# EAGLE design LogicLab (EAGLE 7.6.0)
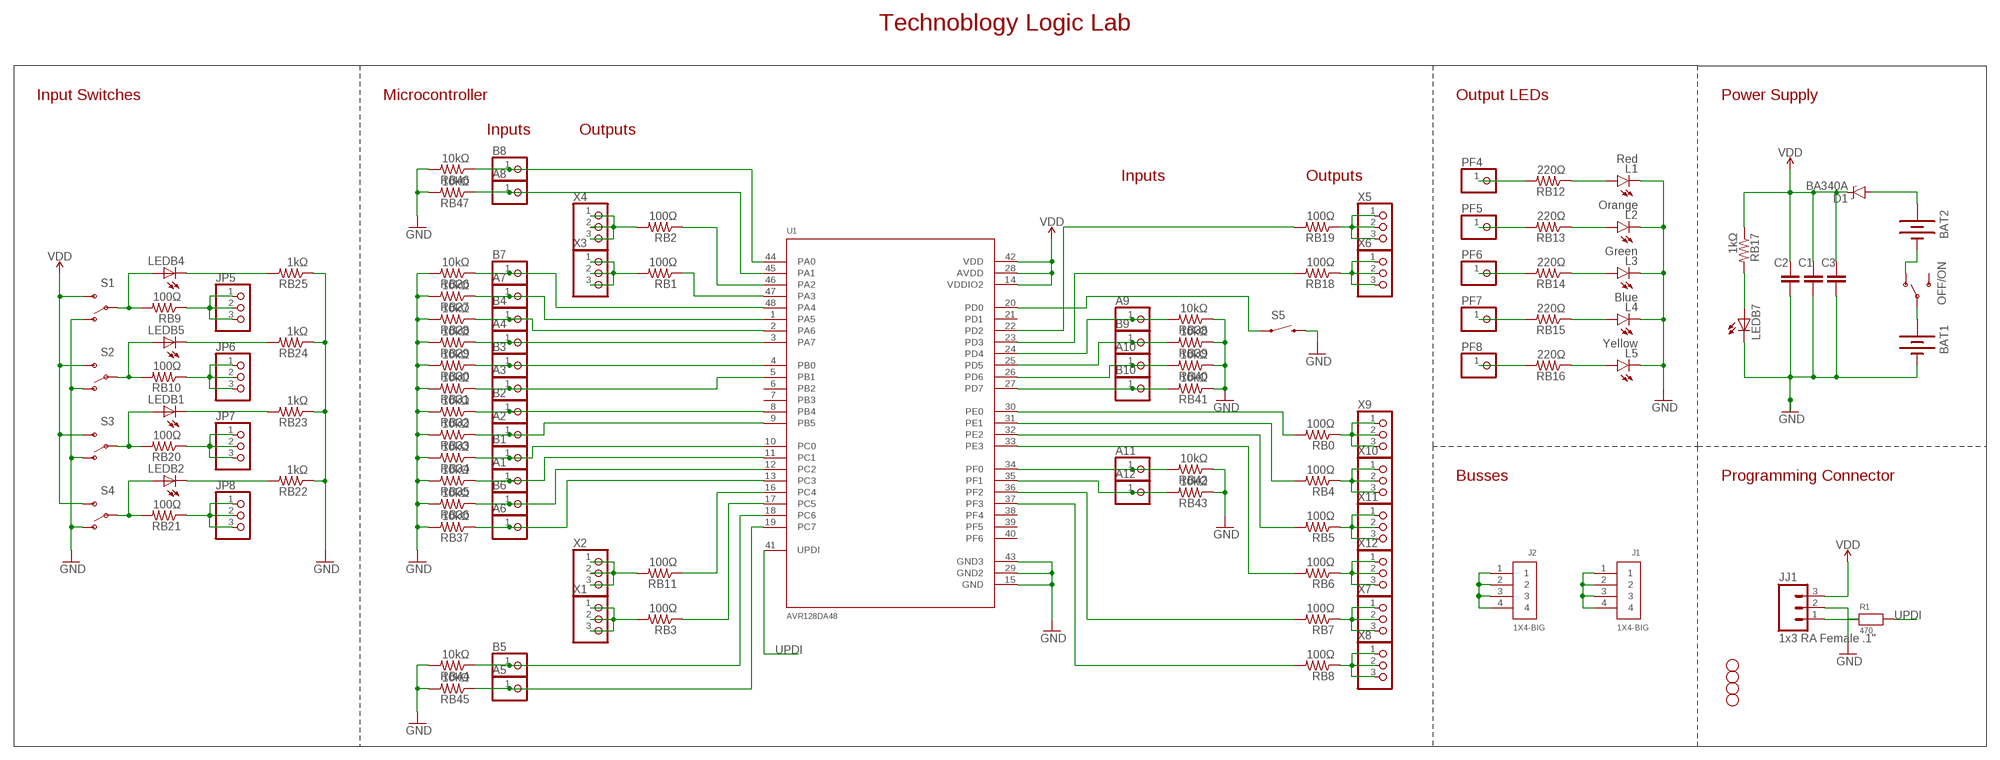
[diagram p0: schematic, sheet 1]

## Parts
A1  PINHD-1X1  [1X01]
A2  PINHD-1X1  [1X01]
A3  PINHD-1X1  [1X01]
A4  PINHD-1X1  [1X01]
A5  PINHD-1X1  [1X01]
A6  PINHD-1X1  [1X01]
A7  PINHD-1X1  [1X01]
A8  PINHD-1X1  [1X01]
A9  PINHD-1X1  [1X01]
A10  PINHD-1X1  [1X01]
A11  PINHD-1X1  [1X01]
A12  PINHD-1X1  [1X01]
B1  PINHD-1X1  [1X01]
B2  PINHD-1X1  [1X01]
B3  PINHD-1X1  [1X01]
B4  PINHD-1X1  [1X01]
B5  PINHD-1X1  [1X01]
B6  PINHD-1X1  [1X01]
B7  PINHD-1X1  [1X01]
B8  PINHD-1X1  [1X01]
B9  PINHD-1X1  [1X01]
B10  PINHD-1X1  [1X01]
BAT1  BATTERYAAA-KIT  [BATTERY-AAA-KIT]
BAT2  BATTERYAAA-KIT  [BATTERY-AAA-KIT]
C1  100n  CAP0805  [0805]
C2  100n  CAP0805  [0805]
C3  10uF  CAP0805  [0805]
D1  BA340A  B340A  [SMA-DIODE]
J1  1X4-BIG  [1X04-BIG]
J2  1X4-BIG  [1X04-BIG]
JJ1  1x3 RA Female .1"  M03SMD_RA_FEMALE  [1X03_SMD_RA_FEMALE]
JP1  STAND-OFF  [STAND-OFF]
JP2  STAND-OFF  [STAND-OFF]
JP3  STAND-OFF  [STAND-OFF]
JP4  STAND-OFF  [STAND-OFF]
JP5  PINHD-1X3  [1X03]
JP6  PINHD-1X3  [1X03]
JP7  PINHD-1X3  [1X03]
JP8  PINHD-1X3  [1X03]
L1  Red  LED5MM  [LED5MM]
L2  Orange  LED5MM  [LED5MM]
L3  Green  LED5MM  [LED5MM]
L4  Blue  LED5MM  [LED5MM]
L5  Yellow  LED5MM  [LED5MM]
LEDB1  LEDCHIPLED_0805  [CHIPLED_0805]
LEDB2  LEDCHIPLED_0805  [CHIPLED_0805]
LEDB4  LEDCHIPLED_0805  [CHIPLED_0805]
LEDB5  LEDCHIPLED_0805  [CHIPLED_0805]
LEDB7  LEDCHIPLED_0805  [CHIPLED_0805]
OFF/ON  SWITCH-SPDTKIT  [SWITCH-SPDT_KIT]
PF4  PINHD-1X1  [1X01]
PF5  PINHD-1X1  [1X01]
PF6  PINHD-1X1  [1X01]
PF7  PINHD-1X1  [1X01]
PF8  PINHD-1X1  [1X01]
R1  470  RESISTOR_0805MP  [_0805MP]
RB0  100Ω  RESISTOR0805-RES  [0805]
RB1  100Ω  RESISTOR0805-RES  [0805]
RB2  100Ω  RESISTOR0805-RES  [0805]
RB3  100Ω  RESISTOR0805-RES  [0805]
RB4  100Ω  RESISTOR0805-RES  [0805]
RB5  100Ω  RESISTOR0805-RES  [0805]
RB6  100Ω  RESISTOR0805-RES  [0805]
RB7  100Ω  RESISTOR0805-RES  [0805]
RB8  100Ω  RESISTOR0805-RES  [0805]
RB9  100Ω  RESISTOR0805-RES  [0805]
RB10  100Ω  RESISTOR0805-RES  [0805]
RB11  100Ω  RESISTOR0805-RES  [0805]
RB12  220Ω  RESISTOR0805-RES  [0805]
RB13  220Ω  RESISTOR0805-RES  [0805]
RB14  220Ω  RESISTOR0805-RES  [0805]
RB15  220Ω  RESISTOR0805-RES  [0805]
RB16  220Ω  RESISTOR0805-RES  [0805]
RB17  1kΩ  RESISTOR0805-RES  [0805]
RB18  100Ω  RESISTOR0805-RES  [0805]
RB19  100Ω  RESISTOR0805-RES  [0805]
RB20  100Ω  RESISTOR0805-RES  [0805]
RB21  100Ω  RESISTOR0805-RES  [0805]
RB22  1kΩ  RESISTOR0805-RES  [0805]
RB23  1kΩ  RESISTOR0805-RES  [0805]
RB24  1kΩ  RESISTOR0805-RES  [0805]
RB25  1kΩ  RESISTOR0805-RES  [0805]
RB26  10kΩ  RESISTOR0805-RES  [0805]
RB27  10kΩ  RESISTOR0805-RES  [0805]
RB28  10kΩ  RESISTOR0805-RES  [0805]
RB29  10kΩ  RESISTOR0805-RES  [0805]
RB30  10kΩ  RESISTOR0805-RES  [0805]
RB31  10kΩ  RESISTOR0805-RES  [0805]
RB32  10kΩ  RESISTOR0805-RES  [0805]
RB33  10kΩ  RESISTOR0805-RES  [0805]
RB34  10kΩ  RESISTOR0805-RES  [0805]
RB35  10kΩ  RESISTOR0805-RES  [0805]
RB36  10kΩ  RESISTOR0805-RES  [0805]
RB37  10kΩ  RESISTOR0805-RES  [0805]
RB38  10kΩ  RESISTOR0805-RES  [0805]
RB39  10kΩ  RESISTOR0805-RES  [0805]
RB40  10kΩ  RESISTOR0805-RES  [0805]
RB41  10kΩ  RESISTOR0805-RES  [0805]
RB42  10kΩ  RESISTOR0805-RES  [0805]
RB43  10kΩ  RESISTOR0805-RES  [0805]
RB44  10kΩ  RESISTOR0805-RES  [0805]
RB45  10kΩ  RESISTOR0805-RES  [0805]
RB46  10kΩ  RESISTOR0805-RES  [0805]
RB47  10kΩ  RESISTOR0805-RES  [0805]
S1  SWITCH-SPDTKIT  [SWITCH-SPDT_KIT]
S2  SWITCH-SPDTKIT  [SWITCH-SPDT_KIT]
S3  SWITCH-SPDTKIT  [SWITCH-SPDT_KIT]
S4  SWITCH-SPDTKIT  [SWITCH-SPDT_KIT]
S5  SWITCH-MOMENTARY-2SMD-4.6X2.8MM  [TACTILE_SWITCH_SMD_4.6X2.8MM]
U1  AVR128DA48  AVR128DB48  [LQFP48]
X1  PINHD-1X3  [1X03]
X2  PINHD-1X3  [1X03]
X3  PINHD-1X3  [1X03]
X4  PINHD-1X3  [1X03]
X5  PINHD-1X3  [1X03]
X6  PINHD-1X3  [1X03]
X7  PINHD-1X3  [1X03]
X8  PINHD-1X3  [1X03]
X9  PINHD-1X3  [1X03]
X10  PINHD-1X3  [1X03]
X11  PINHD-1X3  [1X03]
X12  PINHD-1X3  [1X03]

## Nets
COM: BAT1.PWR@1(+) OFF/ON.2(P)
GND: BAT1.GND@1(-) C1.2 C2.2 C3.2 JJ1.2 L1.K(C) L2.K(C) L3.K(C) L4.K(C) L5.K(C) LEDB7.C RB22.1 RB23.1 RB24.1 RB25.1 RB26.2 RB27.2 RB28.2 RB29.2 RB30.2 RB31.2 RB32.2 RB33.2 RB34.2 RB35.2 RB36.2 RB37.2 RB38.1 RB39.1 RB40.1 RB41.1 RB42.1 RB43.1 RB44.2 RB45.2 RB46.2 RB47.2 S1.1(O) S2.1(O) S3.1(O) S4.1(O) S5.3 S5.4 U1.15(GND) U1.29(GND2) U1.43(GND3)
N$1: A7.1 RB27.1 U1.1(PA5)
N$6: RB18.1 X6.1 X6.2 X6.3
N$7: RB19.1 X5.1 X5.2 X5.3
N$8: B4.1 RB28.1 U1.2(PA6)
N$9: PF4.1 RB12.2
N$10: PF5.1 RB13.2
N$11: PF6.1 RB14.2
N$12: B10.1 RB41.2 U1.27(PD7)
N$13: A10.1 RB40.2 U1.26(PD6)
N$14: RB18.2 U1.23(PD3)
N$15: A4.1 RB29.1 U1.3(PA7)
N$16: PF7.1 RB15.2
N$17: BAT2.PWR@1(+) D1.A
N$18: RB0.1 X9.1 X9.2 X9.3
N$19: A1.1 RB35.1 U1.11(PC1)
N$20: S5.1 S5.2 U1.20(PD0)
N$21: RB4.1 X10.1 X10.2 X10.3
N$22: B6.1 RB36.1 U1.12(PC2)
N$23: RB19.2 U1.22(PD2)
N$24: A9.1 RB38.2 U1.24(PD4)
N$25: B9.1 RB39.2 U1.25(PD5)
N$26: B3.1 RB30.1 U1.4(PB0)
N$27: A3.1 RB31.1 U1.5(PB1)
N$28: B8.1 RB46.1 U1.44(PA0)
N$29: A6.1 RB37.1 U1.13(PC3)
N$30: B1.1 RB34.1 U1.10(PC0)
N$31: RB5.1 X11.1 X11.2 X11.3
N$32: RB11.1 U1.16(PC4)
N$33: A2.1 RB33.1 U1.9(PB5)
N$34: B2.1 RB32.1 U1.8(PB4)
N$35: B5.1 RB44.1 U1.18(PC6)
N$36: RB6.1 X12.1 X12.2 X12.3
N$37: A5.1 RB45.1 U1.19(PC7)
N$38: LEDB4.A RB9.2 S1.2(P)
N$39: B7.1 RB26.1 U1.48(PA4)
N$40: A8.1 RB47.1 U1.45(PA1)
N$41: RB7.1 X7.1 X7.2 X7.3
N$42: RB1.1 U1.47(PA3)
N$43: LEDB5.A RB10.2 S2.2(P)
N$44: RB2.1 U1.46(PA2)
N$45: RB3.1 U1.17(PC5)
N$46: RB0.2 U1.30(PE0)
N$47: RB4.2 U1.31(PE1)
N$48: RB5.2 U1.32(PE2)
N$49: RB6.2 U1.33(PE3)
N$50: RB8.1 X8.1 X8.2 X8.3
N$51: A11.1 RB42.2 U1.34(PF0)
N$52: A12.1 RB43.2 U1.35(PF1)
N$53: PF8.1 RB16.2
N$54: RB7.2 U1.36(PF2)
N$55: RB8.2 U1.37(PF3)
N$56: LEDB1.A RB20.2 S3.2(P)
N$57: LEDB2.A RB21.2 S4.2(P)
N$58: RB11.2 X2.1 X2.2 X2.3
N$59: RB3.2 X1.1 X1.2 X1.3
N$60: RB2.2 X4.1 X4.2 X4.3
N$61: RB1.2 X3.1 X3.2 X3.3
N$62: L1.A RB12.1
N$63: L2.A RB13.1
N$64: L3.A RB14.1
N$65: L4.A RB15.1
N$66: L5.A RB16.1
N$68: JP8.1 JP8.2 JP8.3 RB21.1
N$69: JP7.1 JP7.2 JP7.3 RB20.1
N$70: LEDB7.A RB17.2
N$71: J2.1 J2.2 J2.3 J2.4
N$72: JP6.1 JP6.2 JP6.3 RB10.1
N$73: LEDB2.C RB22.2
N$74: LEDB1.C RB23.2
N$75: JP5.1 JP5.2 JP5.3 RB9.1
N$76: LEDB4.C RB25.2
N$77: LEDB5.C RB24.2
N$78: JJ1.1 R1.1
N$79: J1.1 J1.2 J1.3 J1.4
ON: BAT2.GND@1(-) OFF/ON.1(O)
UPDI: R1.2 U1.41(UPDI)
VDD: C1.1 C2.1 C3.1 D1.C JJ1.3 RB17.1 S1.3(S) S2.3(S) S3.3(S) S4.3(S) U1.14(VDDIO2) U1.28(AVDD) U1.42(VDD)
Unconnected: OFF/ON.3(S) U1.6(PB2) U1.7(PB3) U1.21(PD1) U1.38(PF4) U1.39(PF5) U1.40(PF6)

## Notes on the sheet
- Technoblogy Logic Lab
- Input Switches | Microcontroller | Output LEDs | Power Supply
- Inputs | Outputs
- Inputs | Outputs
- Busses | Programming Connector

## Library data of the parts
A1-A12 B1-B10 PF4-PF8 = adafruit:PINHD-1X1: Pin header 1x1 for 0.1" spacing With round pins
BAT1 BAT2 = SparkFun-Electromechanical:BATTERY: Battery Holders Various common sizes : AA, AAA, 18650 (PRT-12895), 20mm coin cell and 12mm coin cell. 20MM_4LEGS, BATT-10373; PROD_ID: BATT-08571
C1-C3 = SparkFun-Capacitors:CAP: Capacitor Standard 0603 ceramic capacitor, and 0.1" leaded capacitor.
D1 = SparkFun-DiscreteSemi:B340A: Schottky Diode 3A-40V; PROD_ID: DIO-09886
J1 J2 = adafruit:1X4: 4-pin connector
JJ1 = SparkFun-Connectors:M03: Header 3 Standard 3-pin 0.1" header. Use with straight break away headers (SKU : PRT-00116), right angle break away headers (PRT-00553), swiss pins (PRT-00743), machine pins (PRT-00117), and female headers (PRT-00115). Molex polarized connector foot print use with SKU : PRT-08232 with associated crimp pins and housings.; PROD_ID: CONN-10926
JP1-JP4 = SparkFun:STAND-OFF: Stand Off This is the mechanical footprint for a #4 phillips button head screw. Use the keepout ring to avoid running the screw head into surrounding components. SKU : PRT-00447
JP5-JP8 X1-X12 = adafruit:PINHD-1X3: PIN HEADER
L1-L5 = SparkFun-LED:LED: LEDs Standard schematic elements and footprints for 5mm, 3mm, 1206, and 0603 sized LEDs. 5mm - Spark Fun Electronics SKU : COM-00529 (and others)
LEDB1 LEDB2 LEDB4 LEDB5 LEDB7 = adafruit:LED: LED OSRAM: - CHIPLED LG R971, LG N971, LY N971, LG Q971, LY Q971, LO R971, LY R971 LH N974, LH R974 LS Q976, LO Q976, LY Q976 LO Q996 - Hyper CHIPLED LW Q18S LB Q993, LB Q99A, LB R99A - SideLED LS A670, LO A670, LY A670, LG A670, LP A670 LB A673, LV A673, LT A673, LW A673 LH A674 LY A675 LS A676, LA A676, LO A676, LY A676, LW A676 LS A679, LY A679, LG A679 - Hyper Micro SIDELED® LS Y876, LA Y876, LO Y876, LY Y876 LT Y87S - SmartLED LW L88C, LW L88S LB L89C, LB L89S, LG L890 LS L89K, LO L89K, LY L89K LS L896, LA L896, LO L896, LY L896 - TOPLED LS T670, LO T670, LY T670, LG T670, LP T670 LSG T670, LSP T670, LSY T670, LOP T670, LYG T670 LG T671, LOG T671, LSG T671 LB T673, LV T673, LT T673, LW T673 LH T674 LS T676, LA T676, LO T676, LY T676, LB T676, LH T676, LSB T676, LW T676 LB T67C, LV T67C, LT T67C, LS T67K, LO T67K, LY T67K, LW E67C LS E67B, LA E67B, LO E67B, LY E67B, LB E67C, LV E67C, LT E67C LW T67C LS T679, LY T679, LG T679 LS T770, LO T770, LY T770, LG T770, LP T770 LB T773, LV T773, LT T773, LW T773 LH T774 LS E675, LA E675, LY E675, LS T675 LS T776, LA T776, LO T776, LY T776, LB T776 LHGB T686 LT T68C, LB T68C - Hyper Mini TOPLED® LB M676 - Mini TOPLED Santana® LG M470 LS M47K, LO M47K, LY M47K Source: http://www.osram.convergy.de/
OFF/ON S1-S4 = SparkFun-Electromechanical:SWITCH-SPDT: SPDT Switch Simple slide switch, Spark Fun Electronics SKU : COM-00102 DPDT SMT slide switch, AYZ0202, SWCH-08179; PROD_ID: SWCH-08261
R1 = microbuilder:RESISTOR: Resistors 0402 - 0402 Surface Mount Package 22 Ohm 1% 1/16W [Digikey: 311-22.0LRTR-ND] 33 Ohm 5% 1/16W 1.0K 5% 1/16W 1.5K 5% 1/16W 2.0K 1% 1/16W 10.0K 1% 1/16W [Digikey: 311-10.0KLRTR-ND] 10.0K 5% 1/16W [Digikey: RMCF0402JT10K0TR-ND] 12.1K 1% 1/16W [Digikey: 311-22.0LRTR-ND] 100.0K 5% 1/16W 0603 - 0603 Surface Mount Package 0 Ohm 1/10 Watt 1% Resistor 15 Ohm 1/10 Watt 1% Resistor 33 Ohm 1/10 Watt 1% Resistor 49.9 Ohm 1/10 Watt 1% Resistor 100 Ohm 1/10 Watt 1% Resistor 150 Ohm 1/10 Watt 1% Resistor 240 Ohm 1/10 Watt 1% Resistor 390 Ohm 1/10 Watt 1% Resistor 560 Ohm 1/10 Watt 1% Resistor 680 Ohm 1/10 Watt 1% Resistor 750 Ohm 1/10 Watt 1% Resistor 1.0K Ohm 1/10 Watt 1% Resistor 1.5K Ohm 1/10 Watt 1% Resistor 2.0K Ohm 1/10 Watt 1% Resistor 2.2K Ohm 1/10 Watt 1% Resistor 3.3K Ohm 1/10 Watt 1% Resistor 4.7K Ohm 1/10 Watt 1% Resistor 10.0K Ohm 1/10 Watt 1% Resistor 12.0K Ohm 1/10 Watt 1% Resistor 12.1K Ohm 1/10 Watt 1% Resistor 20.0K Ohm 1/10 Watt 1% Resistor 33.0K Ohm 1/10 Watt 1% Resistor 100.0K Ohm 1/10 Watt 1% Resistor 0805 - 0805 Surface Mount Package 0 Ohm 1/8 Watt 1% Resistor 33 Ohm 1/8 Watt 1% Resistor 100 Ohm 1/8 Watt 1% Resistor 150 Ohm 1/8 Watt 1% Resistor 200 Ohm 1/8 Watt 1% Resistor 240 Ohm 1/8 Watt 1% Resistor 330 Ohm 1/8 Watt 1% Resistor 390 Ohm 1/8 Watt 1% Resistor 470 Ohm 1/8 Watt 1% Resistor 1.0K Ohm 1/8 Watt 1% Resistor 1.5K Ohm 1/8 Watt 1% Resistor 2.0K Ohm 1/8 Watt 1% Resistor 4.7K Ohm 1/8 Watt 1% Resistor 5.1K Ohm 1/8 Watt 1% Resistor 5.6K Ohm 1/8 Watt 1% Resistor 10.0K Ohm 1/8 Watt 1% Resistor 22.0K Ohm 1/8 Watt 1% Resistor 33.0K Ohm 1/8 Watt 1% Resistor 100K Ohm 1/8 Watt 1% Resistor 1206 - 1206 Surface Mount Package 2012 - 2010 Surface Mount Package 0.11 Ohm 1/2 Watt 1% Resistor - Digikey: RHM.11UCT-ND
RB0 RB1-RB47 = SparkFun-Resistors:RESISTOR: Resistor Basic schematic elements and footprints for 0603, 1206, and PTH resistors.
S5 = SparkFun-Electromechanical:SWITCH-MOMENTARY-2: Various NO switches- pushbuttons, reed, etc; PROD_ID: SWCH-13065
U1 = technoblogy:AVR128DB48: AVR128DB48 MCU QFP48 Package ARM Cortex M0, 50MHz Operation, 8 Channel 10-Bit ADC, 1²C, 2xSPI, UART, 2x16 Bit and 2x32 Bit Timers, Internal 12MHz Oscillator, 1.8-3.6V operation. Model Flash SRAM Part N°: Digikey Mouser LPC1113 24KB 8KB LPC1113FBD48/301 TBD TBD LPC1114 32KB 8KB LPC1114FBD48/301 568-4950-ND 771-LPC1114FBD483011; DIGIKEY#: 568-4950-ND; MANF: NXP; MANF#: LPC1114FBD48/301,1

## Net classes
0 default: width 0.152 mm, drill 0.305 mm, clearance 0.152 mm

## Board
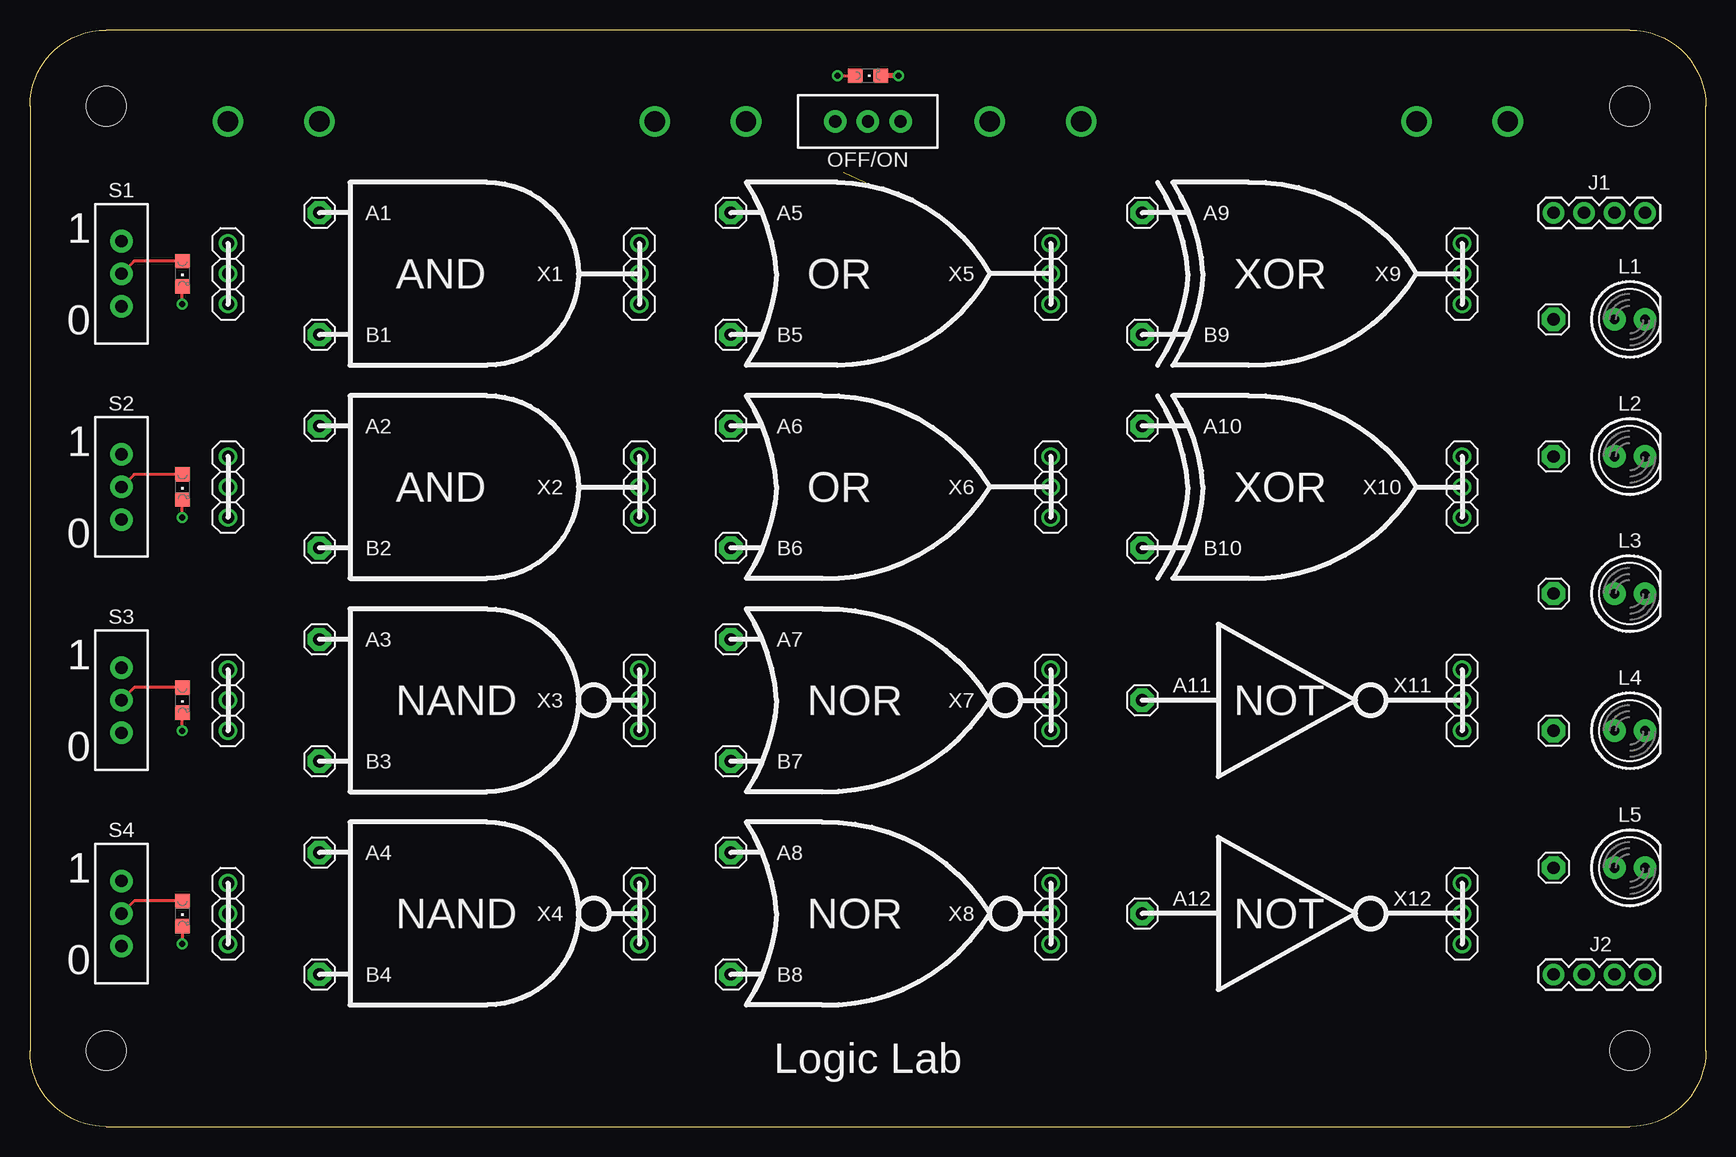
[diagram p1: board, top side]
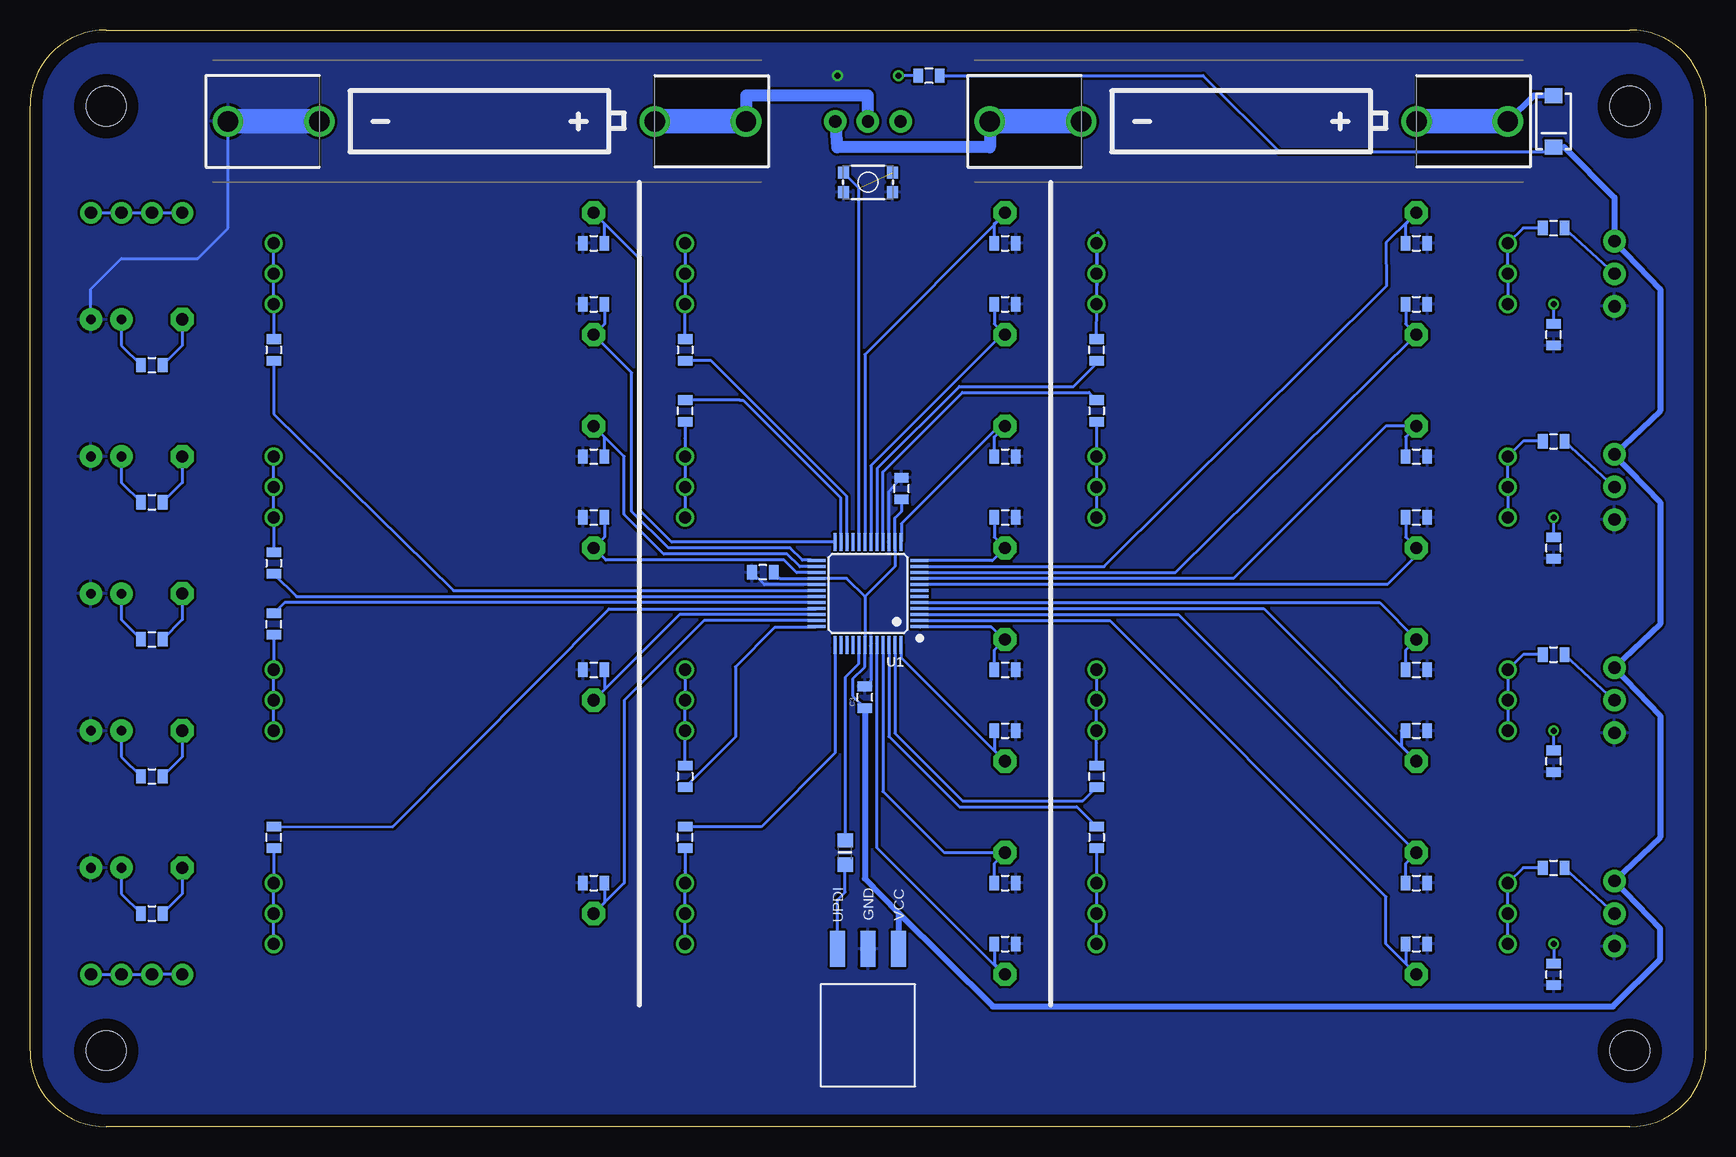
[diagram p2: board, bottom side, seen from below]

Size 139.7 x 91.44 mm. Coordinates in mm from the lower left corner, seen from the top.
Outline: 6.35,0 133.35,0 arc90 139.7,6.35 139.7,85.09 arc90 133.35,91.44 6.35,91.44 arc90 0,85.09 0,6.35 arc90 6.35,0
Copper layers (1*16): Top 0.035mm / dielectric 1.5mm / Bottom 0.035mm
Design rules "default *": minimum track width 10mil, minimum drill 24mil, track to track 8mil, track to pad 8mil, pad to pad 8mil, via to via 8mil, smd to smd 8mil, copper to edge 40mil, drill to drill 8mil, minimum pad ring 10mil, minimum via ring 8mil, stop-mask expansion 4mil, vias tented up to drill 20mil, thermal gap 10mil

### Footprints (pad centres in the part's own frame; a part is rotated, then mirrored left to right if it is on the bottom)
1X01 = drill 1.016 pad 1.93 octagon: 1 0,0
BATTERY-AAA-KIT = drill 1.702: GND@1 21.59,0; GND@2 13.97,0; PWR@1 -21.59,0; PWR@2 -13.97,0
0805 = smd 0.8 x 1.2: 1 -0.9,0; 2 0.9,0
SMA-DIODE = smd 1.27 x 1.47: A -2.15,0; C 2.15,0
1X04-BIG = drill 1.016 pad 1.778: 1 0,0; 2 2.54,0; 3 5.08,0; 4 7.62,0
1X03_SMD_RA_FEMALE = smd 1.25 x 3: 1 -2.54,7.225; 2 0,7.225; 3 2.54,7.225
STAND-OFF = hole 3.302: 0,0
1X03 = drill 1.016: 1 -2.54,0; 2 0,0; 3 2.54,0
LED5MM = drill 0.813 pad 1.88: A -1.27,0; K 1.27,0
CHIPLED_0805 = smd 1.2 x 1.2: A 0,-1.05; C 0,1.05
SWITCH-SPDT_KIT = drill 1.016 pad 1.88: 1 0,2.718; 2 0,0; 3 0,-2.718
_0805MP = smd 1.2 x 1.3: 1 -1.016,0; 2 1.016,0
TACTILE_SWITCH_SMD_4.6X2.8MM = smd 0.9 x 1: 1 -2.05,-0.8; 2 2.05,-0.8; 3 2.05,0.8; 4 -2.05,0.8
LQFP48 = smd 1.5 x 0.25: 1 -4.3,2.75; 2 -4.3,2.25; 3 -4.3,1.75; 4 -4.3,1.25; 5 -4.3,0.75; 6 -4.3,0.25; 7 -4.3,-0.25; 8 -4.3,-0.75; 9 -4.3,-1.25; 10 -4.3,-1.75; 11 -4.3,-2.25; 12 -4.3,-2.75; 25 4.3,-2.75; 26 4.3,-2.25; 27 4.3,-1.75; 28 4.3,-1.25; 29 4.3,-0.75; 30 4.3,-0.25; 31 4.3,0.25; 32 4.3,0.75; 33 4.3,1.25; 34 4.3,1.75; 35 4.3,2.25; 36 4.3,2.75 | smd 0.25 x 1.5: 13 -2.75,-4.3; 14 -2.25,-4.3; 15 -1.75,-4.3; 16 -1.25,-4.3; 17 -0.75,-4.3; 18 -0.25,-4.3; 19 0.25,-4.3; 20 0.75,-4.3; 21 1.25,-4.3; 22 1.75,-4.3; 23 2.25,-4.3; 24 2.75,-4.3; 37 2.75,4.3; 38 2.25,4.3; 39 1.75,4.3; 40 1.25,4.3; 41 0.75,4.3; 42 0.25,4.3; 43 -0.25,4.3; 44 -0.75,4.3; 45 -1.25,4.3; 46 -1.75,4.3; 47 -2.25,4.3; 48 -2.75,4.3

### Placement (x,y rotation side)
A1  24.13,76.2 0 top
A2  24.13,58.42 0 top
A3  24.13,40.64 0 top
A4  24.13,22.86 0 top
A5  58.42,76.2 0 top
A6  58.42,58.42 0 top
A7  58.42,40.64 0 top
A8  58.42,22.86 0 top
A9  92.71,76.2 0 top
A10  92.71,58.42 0 top
A11  92.71,35.56 0 top
A12  92.71,17.78 0 top
B1  24.13,66.04 0 top
B2  24.13,48.26 0 top
B3  24.13,30.48 0 top
B4  24.13,12.7 0 top
B5  58.42,66.04 0 top
B6  58.42,48.26 0 top
B7  58.42,30.48 0 top
B8  58.42,12.7 0 top
B9  92.71,66.04 0 top
B10  92.71,48.26 0 top
BAT1  101.6,83.82 180 bottom
BAT2  38.1,83.82 180 bottom
C1  67.06,53.21 90 bottom
C2  78.61,46.23 180 bottom
C3  70.1,35.81 90 bottom
D1  12.7,83.82 270 bottom
J1  127,76.2 0 top
J2  127,12.7 0 top
JJ1  69.85,7.62 0 bottom
JP1  6.35,85.09 0 top
JP2  6.35,6.35 0 top
JP3  133.35,6.35 0 top
JP4  133.35,85.09 0 top
JP5  16.51,71.12 90 top
JP6  16.51,53.34 90 top
JP7  16.51,35.56 90 top
JP8  16.51,17.78 90 top
L1  133.35,67.31 0 top
L2  133.35,55.88 0 top
L3  133.35,44.45 0 top
L4  133.35,33.02 0 top
L5  133.35,21.59 0 top
LEDB1  12.7,35.56 180 top
LEDB2  12.7,17.78 180 top
LEDB4  12.7,71.12 180 top
LEDB5  12.7,53.34 180 top
LEDB7  69.85,87.63 270 top
OFF/ON  69.85,83.82 270 top
PF4  127,67.31 0 top
PF5  127,55.88 0 top
PF6  127,44.45 0 top
PF7  127,33.02 0 top
PF8  127,21.59 0 top
R1  71.75,22.86 90 bottom
RB0  119.38,64.77 270 bottom
RB1  50.8,29.21 90 bottom
RB2  50.8,24.13 270 bottom
RB3  50.8,64.77 90 bottom
RB4  119.38,46.99 270 bottom
RB5  119.38,41.91 90 bottom
RB6  119.38,24.13 90 bottom
RB7  85.09,29.21 270 bottom
RB8  85.09,24.13 90 bottom
RB9  12.7,74.93 0 bottom
RB10  12.7,57.15 0 bottom
RB11  50.8,59.69 270 bottom
RB12  129.54,63.5 0 bottom
RB13  129.54,52.07 0 bottom
RB14  129.54,40.64 0 bottom
RB15  129.54,29.21 0 bottom
RB16  129.54,17.78 0 bottom
RB17  64.77,87.63 180 bottom
RB18  85.09,59.69 90 bottom
RB19  85.09,64.77 270 bottom
RB20  12.7,39.37 0 bottom
RB21  12.7,21.59 0 bottom
RB22  12.7,12.7 90 bottom
RB23  12.7,30.48 90 bottom
RB24  12.7,48.26 90 bottom
RB25  12.7,66.04 90 bottom
RB26  58.42,33.02 0 bottom
RB27  58.42,38.1 0 bottom
RB28  24.13,15.24 0 bottom
RB29  24.13,20.32 0 bottom
RB30  24.13,33.02 0 bottom
RB31  24.13,38.1 0 bottom
RB32  24.13,50.8 0 bottom
RB33  24.13,55.88 0 bottom
RB34  24.13,68.58 0 bottom
RB35  24.13,73.66 0 bottom
RB36  58.42,50.8 0 bottom
RB37  58.42,55.88 0 bottom
RB38  92.71,73.66 0 bottom
RB39  92.71,68.58 0 bottom
RB40  92.71,55.88 0 bottom
RB41  92.71,50.8 0 bottom
RB42  92.71,38.1 0 bottom
RB43  92.71,20.32 0 bottom
RB44  58.42,68.58 0 bottom
RB45  58.42,73.66 0 bottom
RB46  58.42,15.24 0 bottom
RB47  58.42,20.32 0 bottom
S1  7.62,71.12 180 top
S2  7.62,53.34 180 top
S3  7.62,35.56 180 top
S4  7.62,17.78 180 top
S5  69.85,78.74 180 bottom
U1  69.85,44.45 180 bottom
X1  50.8,71.12 90 top
X2  50.8,53.34 90 top
X3  50.8,35.56 90 top
X4  50.8,17.78 90 top
X5  85.09,71.12 90 top
X6  85.09,53.34 90 top
X7  85.09,35.56 90 top
X8  85.09,17.78 90 top
X9  119.38,71.12 90 top
X10  119.38,53.34 90 top
X11  119.38,35.56 90 top
X12  119.38,17.78 90 top

### Tracks (layer width: path | path; a pad name or v marks a point on that pad's centre or on a via)
COM
  Bottom 1.016: OFF/ON.2 69.85,85.98 80.01,85.98 BAT1.PWR@1
GND  (via drill 0.5)
  Top 0.406: v72.39,87.63 LEDB7.C
  Bottom 0.254: U1.43 69.6,37.22 C3.2 | U1.15 68.1,52.94 C1.2 | U1.29 78.48,45.2 C2.2 | L1.K 134.62,69.85 132.08,72.39 125.73,72.39 123.19,74.93 BAT1.GND@1
  Bottom 2.032: 115.57,83.82 BAT1.GND@1
  pour Bottom: 0,91.44 139.7,91.44 139.7,0 0,0
N$1
  Bottom 0.254: U1.1 65.51,41.66 59.56,41.66 58.55,40.64 A7.1 59.32,39.74 RB27.1
N$6
  Bottom 0.254: RB18.1 85.1,57.41 X6.3 X6.2 X6.1
N$7
  Bottom 0.254: X5.3 X5.2 X5.1 RB19.1
N$8
  Bottom 0.254: U1.2 49.69,42.2 26.67,19.18 26.67,15.24 B4.1 25.03,13.6 RB28.1
N$9
  Bottom 0.254: PF4.1 127,65.14 RB12.2
N$10
  Bottom 0.254: PF5.1 127,53.71 RB13.2
N$11
  Bottom 0.254: PF6.1 127,42.28 RB14.2
N$12
  Bottom 0.254: U1.27 75.79,46.2 76.83,47.24 91.69,47.24 B10.1 91.81,49.16 RB41.2
N$13
  Bottom 0.254: U1.26 75.53,46.7 76.58,47.75 86.87,47.75 90.17,51.05 90.17,55.88 A10.1 91.81,57.52 RB40.2
N$14
  Bottom 0.254: U1.23 72.1,52.41 80.26,60.58 80.52,60.58 RB18.2
N$15
  Bottom 0.254: U1.3 43.97,42.7 A4.1 25.03,21.96 RB29.1
N$16
  Bottom 0.254: PF7.1 127,30.85 RB15.2
N$17
  Bottom 0.508: D1.A 14.36,85.97 BAT2.PWR@1
  Bottom 1.016: BAT2.PWR@1
N$18
  Bottom 0.254: X9.3 X9.2 X9.1 RB0.1
N$19
  Bottom 0.254: U1.11 50.16,46.7 26.63,70.1 26.67,73.7 24.77,75.56 | A1.1 24.77,75.56 | RB35.1 25.03,75.31 24.77,75.56
N$20  (1 unrouted)
  Bottom 0.254: U1.20 70.6,78.24 S5.2
N$21
  Bottom 0.254: X10.3 X10.2 X10.1 RB4.1
N$22
  Bottom 0.254: U1.12 59.48,47.2 B6.1 59.32,49.16 RB36.1
N$23
  Bottom 0.254: U1.22 71.6,52.55 82.93,63.88 85.08,63.88 RB19.2
N$24
  Bottom 0.254: U1.24 86.22,48.75 88.9,51.44 88.9,72.39 A9.1 91.81,75.3 RB38.2
N$25
  Bottom 0.254: U1.25 74.61,47.24 75.31,47.24 76.33,48.26 86.49,48.26 89.53,51.31 89.53,62.87 B9.1 91.81,66.94 RB39.2
N$26
  Bottom 0.254: U1.4 36.85,43.2 B3.1 25.4,31.75 25.4,33.02 RB30.1
N$27
  Bottom 0.254: U1.5 27.19,43.7 A3.1 25.03,39.74 RB31.1
N$28
  Bottom 0.254: 58.42,12.57 58.55,12.7 | 58.55,12.7 69.09,23.24 69.09,40.14 U1.44 | 58.55,12.7 B8.1 59.32,13.6 RB46.1
N$29
  Bottom 0.254: 67.08,48.77 U1.13 67.06,48.79 67.06,50.29 58.93,58.42 A6.1 59.32,57.52 RB37.1
N$30
  Bottom 0.254: U1.10 44.22,46.2 B1.1 25.03,66.94 RB34.1
N$31
  Bottom 0.254: X11.1 X11.2 X11.3 RB5.1
N$32
  Bottom 0.254: U1.16 68.6,54.59 61.98,61.21 51.42,61.21 RB11.1
N$33
  Bottom 0.254: U1.9 65.53,45.72 39.37,45.72 26.67,58.42 A2.1 25.03,57.52 RB33.1
N$34
  Bottom 0.254: U1.8 65.54,45.21 26.54,45.21 24.13,47.62 B2.1 25.03,49.16 RB32.1
N$35
  Bottom 0.254: U1.18 69.6,55.12 58.67,66.04 B5.1 59.32,66.94 RB44.1
N$36
  Bottom 0.254: X12.1 X12.2 X12.3 RB6.1
N$37
  Bottom 0.254: U1.19 70.1,64.39 58.42,76.07 A5.1 59.32,75.3 RB45.1
N$38
  Top 0.254: LEDB4.A 8.67,72.17 S1.2
  Bottom 0.254: S1.2 RB9.2
N$39
  Bottom 0.254: U1.48 67.08,40.13 67.08,39.14 B7.1 59.32,31.38 RB26.1
N$40
  Bottom 0.254: U1.45 68.6,27.96 63.5,22.86 A8.1 59.32,21.96 RB47.1
N$41
  Bottom 0.254: X7.3 X7.2 X7.1 85.1,32.25 RB7.1
N$42
  Bottom 0.254: U1.47 67.6,32.8 61.98,27.18 51.94,27.18 RB1.1
N$43
  Top 0.254: LEDB5.A 8.67,54.39 S2.2
  Bottom 0.254: RB10.2 S2.2
N$44
  Bottom 0.254: U1.46 68.1,32.54 62.23,26.67 52.44,26.67 RB2.1
N$45
  Bottom 0.254: U1.17 69.09,48.87 69.09,54.86 62.23,61.72 52.7,61.72 50.8,63.63 RB3.1
N$46
  Bottom 0.254: RB0.2 119.37,59.42 104.39,44.7 74.28,44.7 U1.30
N$47
  Bottom 0.254: RB4.2 117.47,44.2 U1.31
N$48
  Bottom 0.254: U1.32 118.49,43.7 RB5.2
N$49
  Bottom 0.254: RB6.2 109.47,25.02 91.44,43.18 74.17,43.18 U1.33
N$50
  Bottom 0.254: X8.1 X8.2 X8.3 85.1,21.35 RB8.1
N$51
  Bottom 0.254: U1.34 85.57,42.7 A11.1 91.81,36.46 RB42.2
N$52
  Bottom 0.254: U1.35 83.53,42.2 90.17,35.56 90.17,20.32 A12.1 91.81,18.68 RB43.2
N$53
  Bottom 0.254: PF8.1 127,19.42 RB16.2
N$54
  Bottom 0.254: U1.36 74.19,41.66 77.6,41.66 80.9,38.35 80.9,32.5 RB7.2
N$55
  Bottom 0.254: U1.37 72.6,31.16 78.74,25.02 85.08,25.02 RB8.2
N$56
  Top 0.254: LEDB1.A 8.67,36.61 S3.2
  Bottom 0.254: RB20.2 S3.2
N$57
  Top 0.254: LEDB2.A 8.67,18.83 S4.2
  Bottom 0.254: S4.2 RB21.2
N$58
  Bottom 0.254: X2.1 X2.2 X2.3 50.79,56.78 RB11.2
N$59
  Bottom 0.254: X1.1 X1.2 X1.3 50.66,74.56 RB3.2
N$60
  Bottom 0.254: X4.1 X4.2 X4.3 50.79,21.73 RB2.2
N$61
  Bottom 0.254: X3.3 X3.2 X3.1 50.79,31.99 RB1.2
N$62
  Bottom 0.254: L1.A 132.08,65.14 RB12.1
N$63
  Bottom 0.254: L2.A 132.08,53.71 RB13.1
N$64
  Bottom 0.254: L3.A 132.08,42.28 RB14.1
N$65
  Bottom 0.254: L4.A 132.08,30.85 RB15.1
N$66
  Bottom 0.254: L5.A 132.08,19.42 RB16.1
N$67
  Bottom 2.032: 16.51,83.82 24.13,83.82
N$68
  Bottom 0.254: JP8.1 JP8.2 JP8.3 15.24,21.59 RB21.1
N$69
  Bottom 0.254: JP7.1 JP7.2 JP7.3 15.24,39.37 RB20.1
N$70  (via drill 0.5)
  Top 0.254: v67.31,87.63 LEDB7.A
  Bottom 0.254: RB17.2 v67.31,87.63
N$71
  Bottom 0.254: J2.1 J2.2 J2.3 J2.4
N$72
  Bottom 0.254: JP6.1 JP6.2 JP6.3 15.24,57.15 RB10.1
N$73  (via drill 0.5)
  Top 0.254: LEDB2.C v12.7,15.24
  Bottom 0.254: v12.7,15.24 RB22.2
N$74  (via drill 0.5)
  Top 0.254: v12.7,33.02 LEDB1.C
  Bottom 0.254: RB23.2 v12.7,33.02
N$75
  Bottom 0.254: JP5.1 JP5.2 JP5.3 15.24,74.93 RB9.1
N$76  (via drill 0.5)
  Top 0.254: v12.7,68.58 LEDB4.C
  Bottom 0.254: RB25.2 v12.7,68.58
N$77  (via drill 0.5)
  Top 0.254: v12.7,50.8 LEDB5.C
  Bottom 0.254: RB24.2 v12.7,50.8
N$78
  Bottom 0.254: JJ1.1 72.39,18.92 71.75,19.56 R1.1
N$79
  Bottom 0.254: J1.4 J1.3 J1.2 J1.1
N$80
  Bottom 2.032: 80.01,83.82 87.63,83.82
ON
  Bottom 1.016: BAT2.GND@1 59.69,81.66 72.39,81.66 OFF/ON.1
  Bottom 2.032: 52.07,83.82 BAT2.GND@1
UPDI
  Bottom 0.254: U1.41 70.61,40.14 70.61,38.61 71.75,37.47 R1.2
VDD
  Bottom 0.254: 70.1,44.2 U1.42 70.1,38.35 71.12,37.34 71.12,35.93 C3.1 | C1.1 67.06,51.31 67.6,50.76 U1.14 67.6,46.7 70.1,44.2 | C2.1 77.2,45.72 74.17,45.72 U1.28 74.13,45.72 71.63,45.72 70.1,44.2 | JJ1.3 67.28,14.85 | RB17.1 41.91,87.63 35.56,81.28 13.09,81.28 D1.C
  Bottom 0.508: C3.1 70.1,20.7 67.28,17.81 | 67.28,17.81 59.44,10.03 7.75,10.03 3.81,13.97 3.81,16.51 S4.3 3.81,24.13 3.81,34.29 S3.3 3.81,41.91 3.81,52.07 S2.3 3.81,59.69 3.81,69.85 S1.3 7.62,77.47 11.82,81.67 D1.C | 67.28,14.85 67.28,17.81
  Bottom 0.813: D1.C 12.94,81.67

### Text on the board
tPlace: AND | OR | XOR | 1 / / 0 | AND | OR | XOR | 1 / / 0 | NAND | NOR | NOT | 1 / / 0 | NAND | NOR | NOT | 1 / / 0 | Logic Lab
bPlace: VCC | GND | UPDI